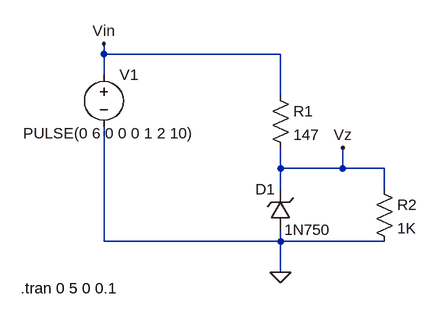
[diagram p0: schematic Zener_diode.asc]
Zener_diode.asc, the LTspice schematic file:
Version 4
SHEET 1 880 680
WIRE 48 0 48 -16
WIRE 320 0 48 0
WIRE 48 32 48 0
WIRE 320 64 320 0
WIRE 320 176 320 144
WIRE 416 176 416 144
WIRE 416 176 320 176
WIRE 480 176 416 176
WIRE 320 208 320 176
WIRE 480 208 480 176
WIRE 48 288 48 112
WIRE 320 288 320 272
WIRE 320 288 48 288
WIRE 480 288 320 288
WIRE 320 336 320 288
FLAG 320 336 0
FLAG 48 -16 Vin
FLAG 416 144 Vz
SYMBOL zener 336 272 R180
WINDOW 0 24 64 Left 2
WINDOW 3 -61 2 Left 2
SYMATTR InstName D1
SYMATTR Value 1N750
SYMBOL voltage 48 16 R0
WINDOW 3 -124 106 Left 2
WINDOW 123 0 0 Left 2
WINDOW 39 0 0 Left 2
WINDOW -1 -124 134 Left 2
WINDOW 1 -124 162 Left 2
SYMATTR Value PULSE(0 6 0 0 0 1 2 10)
SYMATTR InstName V1
SYMBOL res 304 48 R0
SYMATTR InstName R1
SYMATTR Value 147
SYMBOL res 464 192 R0
SYMATTR InstName R2
SYMATTR Value 1K
TEXT -80 360 Left 2 !.tran 0 5 0 0.1

The netlist it stands for:
* Zener_diode.asc
D1 0 Vz 1N750
V1 Vin 0 PULSE(0 6 0 0 0 1 2 10)
R1 Vin Vz 147
R2 Vz 0 1K
.model D D
.lib standard.dio
.tran 0 5 0 0.1
.backanno
.end

* Results of the author's LTspice run, read from the files saved beside the schematic
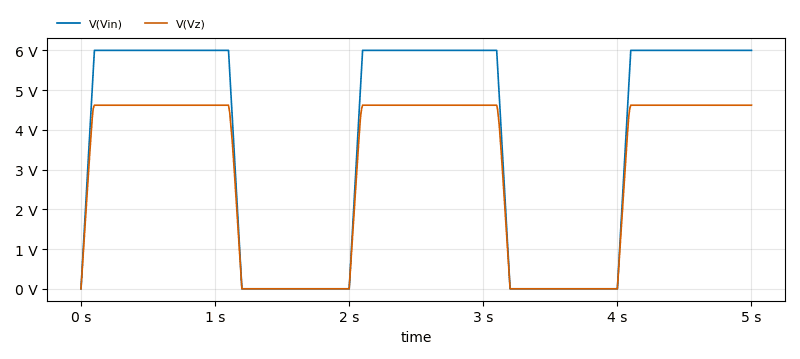
[diagram p1: Transient Analysis of Zener_diode.asc, plotted from the saved traces]
* Transient Analysis, 1 run:
*   V(Vin): min 0 V, max 6 V, average 3.78 V, rms 4.7 V, last 6 V
*   V(Vz): min 0 V, max 4.621 V, average 2.934 V, rms 3.638 V, last 4.62 V